# Altium project TinySAMD.PrjPcb
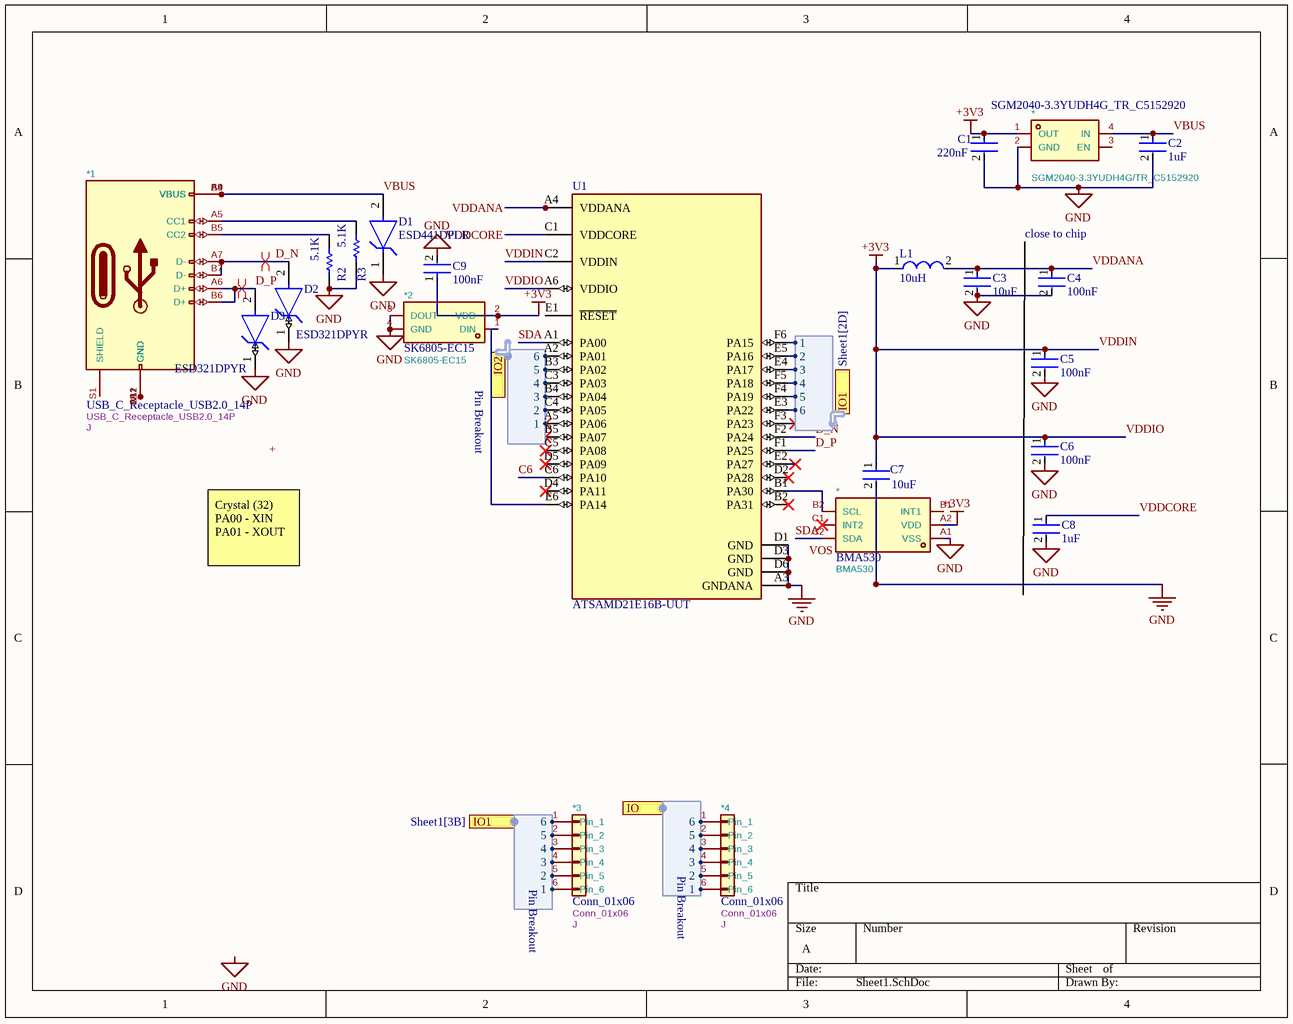
[diagram p0: Sheet1.SchDoc]
1 sheet, 22 parts. Net scope: flat (ports and power ports of the same name join across sheets).
Board file: PCB1.PcbDoc

## Sheet Sheet1.SchDoc
size A; SheetNumber: 1; SheetTotal: 1

### Parts
(Parts that share a designator on the sheet are numbered #1, #2 ... from top to bottom, then left to right.)
*1  USB_C_Receptacle_USB2.0_14P  Reference: J  [USB_C_Receptacle_HRO_TYPE-C-31-M-12]
*2  SK6805-EC15  [LED-SMD_4P-L1.5-W1.5-BL]
*3  Conn_01x06  Reference: J  [PinHeader_1x06_P1.00mm_Vertical]
*4  Conn_01x06  Reference: J  [PinHeader_1x06_P1.00mm_Vertical]
*#1  SGM2040-3.3YUDH4G_TR_C5152920  value SGM2040-3.3YUDH4G/TR_C5152920  [UTDFN-4AL_L1.0-W1.0-P0.65-BL]
*#2  BMA530  [WLCSP-6_L1.0-W0.7-R2-C3-P0.35-BL]
C1  220nF  [FP-CL03-IPC_C]
C2  1uF  [FP-GCM033-0_09-IPC_B]
C3  10uF  [FP-GRM155-0_2-MFG]
C4  100nF  [FP-CC0201-BB-MFG]
C5  100nF  [FP-CC0201-BB-MFG]
C6  100nF  [FP-CC0201-BB-MFG]
C7  10uF  [FP-GRM155-0_2-MFG]
C8  1uF  [FP-CC0201-BA-MFG]
C9  100nF  [FP-CC0201-BB-MFG]
D1  ESD441DPLR  [FP-DPL0002A-MFG]
D2  ESD321DPYR  [FP-DPY0002A-MFG]
D3  ESD321DPYR  [FP-DPY0002A-MFG]
L1  10uH  [FP-LQW15DN_00-MFG]
R2  5.1K  [RESC0603X28X15NL05T05]
R3  5.1K  [RESC0603X28X15NL05T05]
U1  ATSAMD21E16B-UUT  [FP-C04-21245-MFG]

### Ports
IO1 (harness Pin Breakout, see Sheet1[2D]), IO1 (harness Pin Breakout, see Sheet1[3B]), IO2 (harness Pin Breakout), IO (harness Pin Breakout)

### Harnesses
Pin Breakout: 2, 3, 4, 5, 6, 1
Pin Breakout: 1, 2, 3, 4, 5, 6

### Nets
GND: *2.3(DOUT) *2.4(GND) *#1.2(GND) *#2.A1(VSS) C1.2 C2.2 C3.2 C4.2 C5.2 C6.2 C7.2 C8.2 C9.2 D1.1(IO) D2.1(IO) D3.1(IO) R2.2 R3.2 U1.A3(GNDANA) U1.D1(GND) U1.D3(GND) U1.D6(GND)
VDDIN: *2.2(VDD) *#1.1(OUT) *#2.A2(VDD) C1.1 C5.1 C6.1 C7.1 C9.1 L1.1 U1.A6(VDDIO) U1.C2(VDDIN)  [also labelled +3V3, VDDIO]
C6: U1.C6(PA10)
D_N: *1.A7(D-) *1.B7(D-) D2.2(GND) U1.F2(PA24)
D_P: *1.A6(D+) *1.B6(D+) D3.2(GND) U1.F1(PA25)
SDA: *#2.C2(SDA) U1.A1(PA00)
VBUS: *1.A4(VBUS) *1.A9(VBUS) *1.B4(VBUS) *1.B9(VBUS) *#1.4(IN) C2.1 D1.2(GND)
VDDANA: C3.1 C4.1 L1.2 U1.A4(VDDANA)
VDDCORE: C8.1 U1.C1(VDDCORE)
Net*1_A1: *1.A1(GND) *1.A12(GND) *1.B1(GND) *1.B12(GND)
Net*1_A5: *1.A5(CC1) R3.1
Net*1_B5: *1.B5(CC2) R2.1
Net*2_1: *2.1(DIN) U1.E6(PA14)
Net*3_1: *3.1(Pin_1) U1.E3(PA22) ; port IO1.6
Net*3_2: *3.2(Pin_2) U1.F4(PA19) ; port IO1.5
Net*3_3: *3.3(Pin_3) U1.F5(PA18) ; port IO1.4
Net*3_4: *3.4(Pin_4) U1.E4(PA17) ; port IO1.3
Net*3_5: *3.5(Pin_5) U1.E5(PA16) ; port IO1.2
Net*3_6: *3.6(Pin_6) U1.F6(PA15) ; port IO1.1
Net*4_1: *4.1(Pin_1) ; port IO.6
Net*4_2: *4.2(Pin_2) ; port IO.5
Net*4_3: *4.3(Pin_3) ; port IO.4
Net*4_4: *4.4(Pin_4) ; port IO.3
Net*4_5: *4.5(Pin_5) ; port IO.2
Net*4_6: *4.6(Pin_6) ; port IO.1
Net*#2_B2: *#2.B2(SCL) U1.B1(PA30)
NetU1_A2: U1.A2(PA01) ; harness Pin Breakout.6
NetU1_A5: U1.A5(PA06) ; harness Pin Breakout.1
NetU1_B3: U1.B3(PA02) ; harness Pin Breakout.5
NetU1_B4: U1.B4(PA04) ; harness Pin Breakout.3
NetU1_C3: U1.C3(PA03) ; harness Pin Breakout.4
NetU1_C4: U1.C4(PA05) ; harness Pin Breakout.2

Not connected (* = marked no-connect by the designer): *1 S1(SHIELD); *#1 3(EN); *#2 B1(INT1) C1(INT2)*; U1 B2(PA31)* B5(PA07)* C5(PA08)* D2(PA28)* D4(PA11)* D5(PA09)* E1(~{RESET}) E2(PA27)* F3(PA23)*

### Layout directives
differential pair: D_N, D_P

### Notes on the sheet
- (near C4) close to chip
- Crystal (32)
  PA00 - XIN
  PA01 - XOUT
- Labels drawn without touching a wire or pin: +, GND, VOS

### Library data of the parts
*1 = USB_C_Receptacle_USB2.0_14P: USB 2.0-only 14P Type-C Receptacle connector; ki_keywords: usb universal serial bus type-C USB2.0; ki_fp_filters: USB*C*Receptacle*; Value: USB_C_Receptacle_USB2.0_14P; Datasheet: https://www.usb.org/sites/default/files/documents/usb_type-c.zip; Description_: USB 2.0-only 14P Type-C Receptacle connector
*2 = SK6805-EC15: Manufacturer: 欧思科光电; ki_keywords: Light Emitting Diodes (LED); Value: SK6805-EC15; Footprint: easyeda2kicad:LED-SMD_4P-L1.5-W1.5-BL; Supplier: https://www.lcsc.com/datasheet/C2890035.pdf; MPN: SK6805-EC15; LCSC Part: C2890035
*3 *4 = Conn_01x06: Generic connector, single row, 01x06, script generated (kicad-library-utils/schlib/autogen/connector/); ki_fp_filters: Connector*:*_1x??_*; Value: Conn_01x06; Datasheet: ~; Description_: Generic connector, single row, 01x06, script generated (kicad-library-utils/schlib/autogen/connector/); ki_keywords: connector
*#1 = SGM2040-3.3YUDH4G_TR_C5152920: Manufacturer: SGMICRO(圣邦微); MPN: SGM2040-3.3YUDH4G/TR; Footprint: easyeda2kicad:UTDFN-4AL_L1.0-W1.0-P0.65-BL; Supplier: https://www.lcsc.com/datasheet/C5152920.pdf; LCSC Part: C5152920
*#2 = BMA530: Manufacturer: Bosch(博世); Footprint: easyeda2kicad:WLCSP-6_L1.2-W0.8-P0.40-TL; Supplier: https://www.lcsc.com/datasheet/C23296667.pdf; MPN: BMA530; LCSC Part: C23296667; Value: BMA530
C1 = CMP-13271-003809-1: Cap Ceramic 220nF 6.3V X5R ±20% Pad SMD 0201 +85°C T/R
C2 = CMP-06035-063262-1: Chip Multilayer Ceramic Capacitors for Automotive, 1.0μF ±20%, +15.0/-50.0%, 2.5Vdc, 0201 (0603M)
C3 C7 = CMP-00260-135863762-1: GRM155R60J106ME18D; Capacitance: 10µF; Voltage Rating (DC): 6.3V; Dielectric: X5R; Length: 1mm; Lifecycle Status: Production; Thickness: 500µm; NexarPartId: 135863762; Width: 500µm; Case/Package: 0402
C4-C6 C9 = CMP-03422-001280-2: CAP CER 0.1UF 25V X5R 0201
C8 = CMP-03422-000660-2: CAP CER 1UF 6.3V X5R 0201; Manufacturer: Yageo; Manufacturer Part Number: CC0201MRX5R5BB105; Tolerance: 0.2; Material: Ceramic; Temperature Coefficient: 15%; Package: CC0201-BA; Category: Cap; Capacitance: 1 uF; Digikey Description: CAP CER 1UF 6.3V X5R 0201; Temperature: -55°C to +85°C; Temperature Range High: +85°C; ComponentLink2Description: Datasheet; Lead Free: Yes; Height: 0.33mm; Voltage Rating: 6.3 V; Temperature Range Low: -55°C; Temperature Characteristic: X5R; Device Class L1: Passive Components; Footprint Url: http://www.yageo.com/exep/pages/download/literatures/UPY-C_GEN_24.pdf; Value: 1 uF; Octopart: https://octopart.com/cc0201mrx5r5bb105-yageo-33242268; Automotive: No; Mouser Description: Multilayer Ceramic Capacitors MLCC - SMD/SMT 1.0uF 6.3V X5R 20%; Device Class L3: Ceramic Capacitors; ComponentLink2URL: http://www.yageo.com/documents/recent/UPY-GPHC_X5R_4V-to-50V_25.pdf; RoHS: TRUE; Ipc Land Pattern Name: CAPC6030X30; Device Class L2: Capacitors
D1 = CMP-00370-140306675-1: ESD441DPLR 1-pF, 5.5-V, 30-KV ESD protection device in 0201 package 2-X2SON -40 to 125; Manufacturer Lifecycle Status: ACTIVE; Number of Channels: 1; Breakdown Voltage: 6V; Capacitance: 1pF; Peak Pulse Current: 6A; Direction: Unidirectional; Peak Pulse Power: 45W; Reverse Standoff Voltage: 5.5V; Clamping Voltage: 3.8V; Lifecycle Status: Production; Length: 600µm; Height: 320µm; Max Operating Temperature: 125°C; Width: 300µm; Number of Pins: 2; Ambient Temperature Range High: 150°C; Min Operating Temperature: -40°C; Thickness: 300µm; NexarPartId: 140306675
D2 D3 = CMP-04989-000001-1: HDMI2.0 ESD PROTECTION; Manufacturer: Texas Instruments; Standoff Height: 0mm; Peak Pulse Current: 6A; Value: 0.9pF; Number Of Channels: 1; Reverse Standoff Voltage: 3.6V; Peak Pulse Power: 40W; Breakdown Voltage: 4.5V; Direction: Unidirectional; Clamping Voltage: 6.8V; RoHS: TRUE; Temperature: -40°C to +125°C; Package: DPY0002A; Temperature Range Low: -40°C; Temperature Range High: +125°C; Category: Diode; Capacitance: 0.9pF; Ambient Temperature Range Low: -40°C; Device Class L3: unset; Device Class L1: Circuit Protection; Ambient Temperature Range High: +125°C; ComponentLink2URL: http://www.ti.com/lit/ds/symlink/esd321.pdf; Octopart: https://octopart.com/esd321dpyr-texas+instruments-94354200; Manufacturer Part Number: ESD321DPYR; Digikey Description: HDMI2.0 ESD PROTECTION; Lead Free: Yes; ComponentLink2Description: Datasheet; Device Class L2: TVS Diodes; Height: 0.45mm; Automotive: No
L1 = CMP-06042-016523-1: FIXED IND 10UH 120MA 5.405OHM; RoHS Compliant: Yes
R2 R3 = CMP-2004-00738-1: Part Number: CRCW02015K10JNED; Manufacturer: Vishay Dale
U1 = CMP-00252-77761538-1: ATSAMD21E16B-UUT MCU 32-Bit SAM D21E ARM Cortex M0+ RISC 64KB Flash 1.8V/2.5V/3.3V 35-Pin WLCSP T/R; Number of SPI Channels: 4; Number of PWM Channels: 6; Oscillator Type: Internal; Frequency: 48MHz; Max Junction Temperature (Tj): 100°C; Interface: I2C, LIN, SPI, USART; Peripherals: Brown-out Detect/Reset, DMA, POR, PWM, WDT; Number of I/Os: 26; RAM Size: 8kB; Data Bus Width: 32b; Min Supply Voltage: 1.62V; Number of Timers/Counters: 3; Max Supply Voltage: 3.63V; Number of USB Channels: 1; Number of ADC Channels: 10; Max Operating Temperature: 85°C; Packaging: Tape & Reel (TR); Lifecycle Status: Production; Core Architecture: ARM; Number of UART Channels: 4; RoHS: Compliant; Min Operating Temperature: -40°C; Ambient Temperature Range High: 85°C; Memory Type: FLASH; Height: 483µm; Number of A/D Converters: 1; NexarPartId: 77761538; Number of I2C Channels: 4; Schedule B: 8542310000; Memory Size: 64kB